# EAGLE design tarjeta (EAGLE 9.6.2)
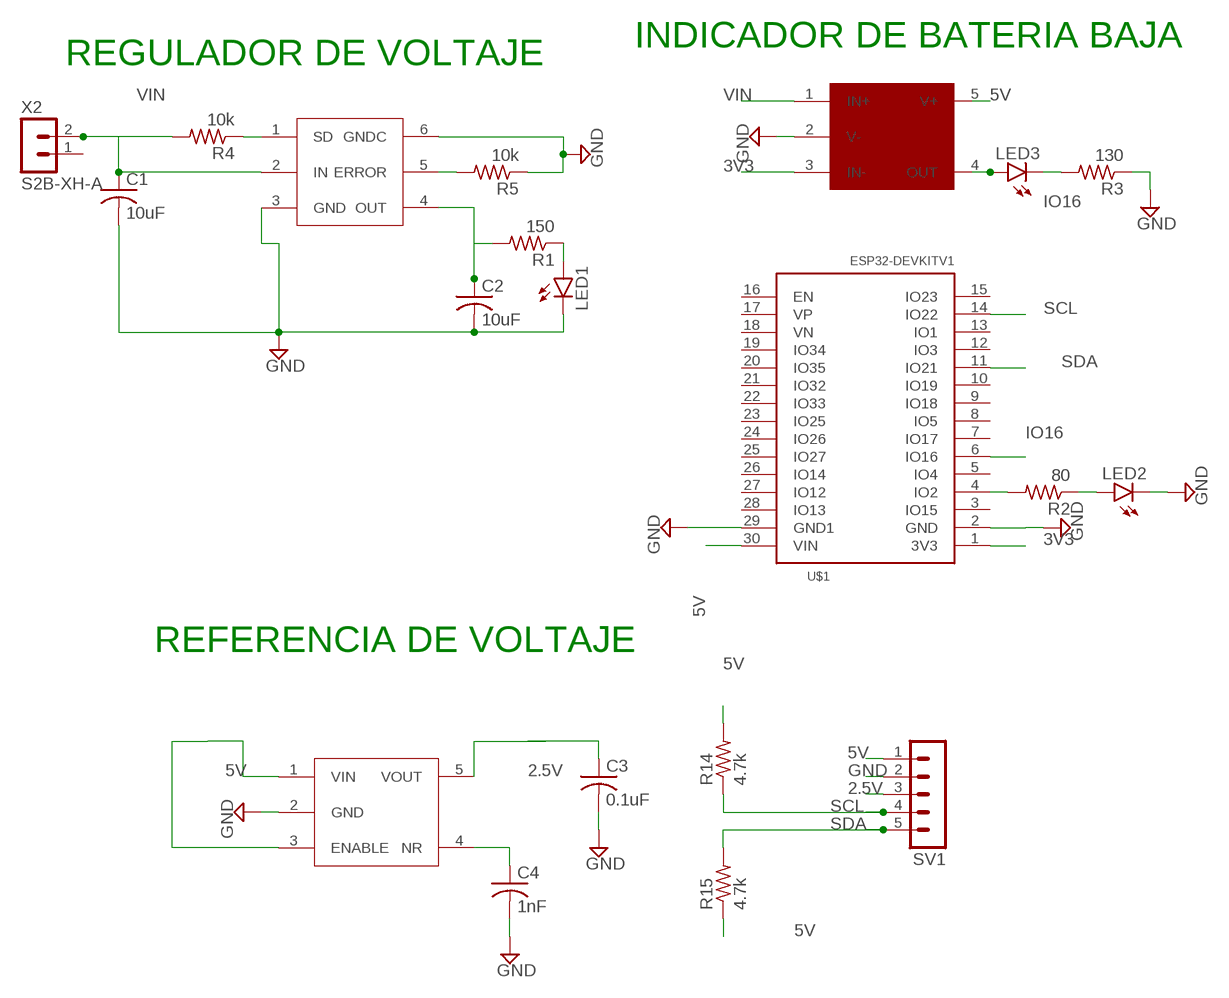
[diagram p0: schematic, sheet 1]

## Parts
.  LP3872ES  [TO263-5]
C1  10uF  C-USC0603  [C0603]
C2  10uF  C-USC0603  [C0603]
C3  0.1uF  C-USC0603  [C0603]
C4  1nF  C-USC0603  [C0603]
LED1  LEDSML0805  [SML0805]
LED2  LEDSML0805  [SML0805]
LED3  LEDSML0805  [SML0805]
R1  150  R-US_R0603  [R0603]
R2  80  R-US_R0603  [R0603]
R3  130  R-US_R0603  [R0603]
R4  10k  R-US_R0603  [R0603]
R5  10k  R-US_R0603  [R0603]
R14  4.7k  R-US_R0603  [R0603]
R15  4.7k  R-US_R0603  [R0603]
SV1  MA05-1  [MA05-1]
U$1  ESP32DEVKITV1  [ESP32-DEVKITV1]
U$3  REG113  [SOT23-5]
U$4  TL081-5  [SOT23-5]
X2  S2B-XH-A  [S2B-XH-A]

## Nets
2.5V: C3.1 SV1.3 U$3.5(VOUT)
3V3: U$1.1(3V3) U$4.3(IN-)
5V: R14.2 R15.1 SV1.1 U$1.30(VIN) U$3.1(VIN) U$3.3(ENABLE) U$4.5(V+)
GND: ..3(GND) ..6(GNDC) C1.2 C2.2 C3.2 C4.2 LED1.C LED2.C R3.1 R5.1 SV1.2 U$1.2(GND) U$1.29(GND1) U$3.2(GND) U$4.2(V-)
IO16: LED3.C R3.2 U$1.6(IO16)
N$1: LED1.A R1.1
N$2: LED3.A U$4.4(OUT)
N$3: R2.2 U$1.4(IO2)
N$4: LED2.A R2.1
N$5: ..1(SD) R4.1
N$6: C4.1 U$3.4(NR)
N$7: ..5(ERROR) R5.2
N$8: ..4(OUT) C2.1 R1.2
SCL: R14.1 SV1.4 U$1.14(IO22)
SDA: R15.2 SV1.5 U$1.11(IO21)
VIN: ..2(IN) C1.1 R4.2 U$4.1(IN+) X2.2
Unconnected: U$1.3(IO15) U$1.5(IO4) U$1.7(IO17) U$1.8(IO5) U$1.9(IO18) U$1.10(IO19) U$1.12(IO3) U$1.13(IO1) U$1.15(IO23) U$1.16(EN) U$1.17(VP) U$1.18(VN) U$1.19(IO34) U$1.20(IO35) U$1.21(IO32) U$1.22(IO33) U$1.23(IO25) U$1.24(IO26) U$1.25(IO27) U$1.26(IO14) U$1.27(IO12) U$1.28(IO13) X2.1

## Notes on the sheet
- INDICADOR DE BATERIA BAJA
- REGULADOR DE VOLTAJE
- REFERENCIA DE VOLTAJE

## Library data of the parts
. = LP3872ES:LP3872ES
C1-C4 = rcl:C-US: CAPACITOR, American symbol; SPICEPREFIX: C
LED1-LED3 = led:LED: LED OSRAM: - CHIPLED LG R971, LG N971, LY N971, LG Q971, LY Q971, LO R971, LY R971 LH N974, LH R974 LS Q976, LO Q976, LY Q976 LO Q996 - Hyper CHIPLED LW Q18S LB Q993, LB Q99A, LB R99A - SideLED LS A670, LO A670, LY A670, LG A670, LP A670 LB A673, LV A673, LT A673, LW A673 LH A674 LY A675 LS A676, LA A676, LO A676, LY A676, LW A676 LS A679, LY A679, LG A679 - Hyper Micro SIDELED® LS Y876, LA Y876, LO Y876, LY Y876 LT Y87S - SmartLED LW L88C, LW L88S LB L89C, LB L89S, LG L890 LS L89K, LO L89K, LY L89K LS L896, LA L896, LO L896, LY L896 - TOPLED LS T670, LO T670, LY T670, LG T670, LP T670 LSG T670, LSP T670, LSY T670, LOP T670, LYG T670 LG T671, LOG T671, LSG T671 LB T673, LV T673, LT T673, LW T673 LH T674 LS T676, LA T676, LO T676, LY T676, LB T676, LH T676, LSB T676, LW T676 LB T67C, LV T67C, LT T67C, LS T67K, LO T67K, LY T67K, LW E67C LS E67B, LA E67B, LO E67B, LY E67B, LB E67C, LV E67C, LT E67C LW T67C LS T679, LY T679, LG T679 LS T770, LO T770, LY T770, LG T770, LP T770 LB T773, LV T773, LT T773, LW T773 LH T774 LS E675, LA E675, LY E675, LS T675 LS T776, LA T776, LO T776, LY T776, LB T776 LHGB T686 LT T68C, LB T68C - Hyper Mini TOPLED® LB M676 - Mini TOPLED Santana® LG M470 LS M47K, LO M47K, LY M47K Source: http://www.osram.convergy.de LUXEON: - LUMILED® LXK2-PW12-R00, LXK2-PW12-S00, LXK2-PW14-U00, LXK2-PW14-V00 LXK2-PM12-R00, LXK2-PM12-S00, LXK2-PM14-U00 LXK2-PE12-Q00, LXK2-PE12-R00, LXK2-PE12-S00, LXK2-PE14-T00, LXK2-PE14-U00 LXK2-PB12-K00, LXK2-PB12-L00, LXK2-PB12-M00, LXK2-PB14-N00, LXK2-PB14-P00, LXK2-PB14-Q00 LXK2-PR12-L00, LXK2-PR12-M00, LXK2-PR14-Q00, LXK2-PR14-R00 LXK2-PD12-Q00, LXK2-PD12-R00, LXK2-PD12-S00 LXK2-PH12-R00, LXK2-PH12-S00 LXK2-PL12-P00, LXK2-PL12-Q00, LXK2-PL12-R00 Source: www.luxeon.com KINGBRIGHT: KA-3528ASYC Source: www.kingbright.com
R1-R5 R14 R15 = rcl:R-US_: RESISTOR, American symbol; SPICEPREFIX: R
SV1 = con-lstb:MA05-1: PIN HEADER; OC_FARNELL: unknown; OC_NEWARK: unknown
U$1 = ESP32-DEVKITV1:ESP32DEVKITV1
U$3 = REG113:REG113
U$4 = TL081:TL081-5
X2 = con-JST XH:S2B-XH: JST XH series header 2.50mm pitch disconnectable crimp style connectors, horizontal (side entry type), 2 pins

## Board
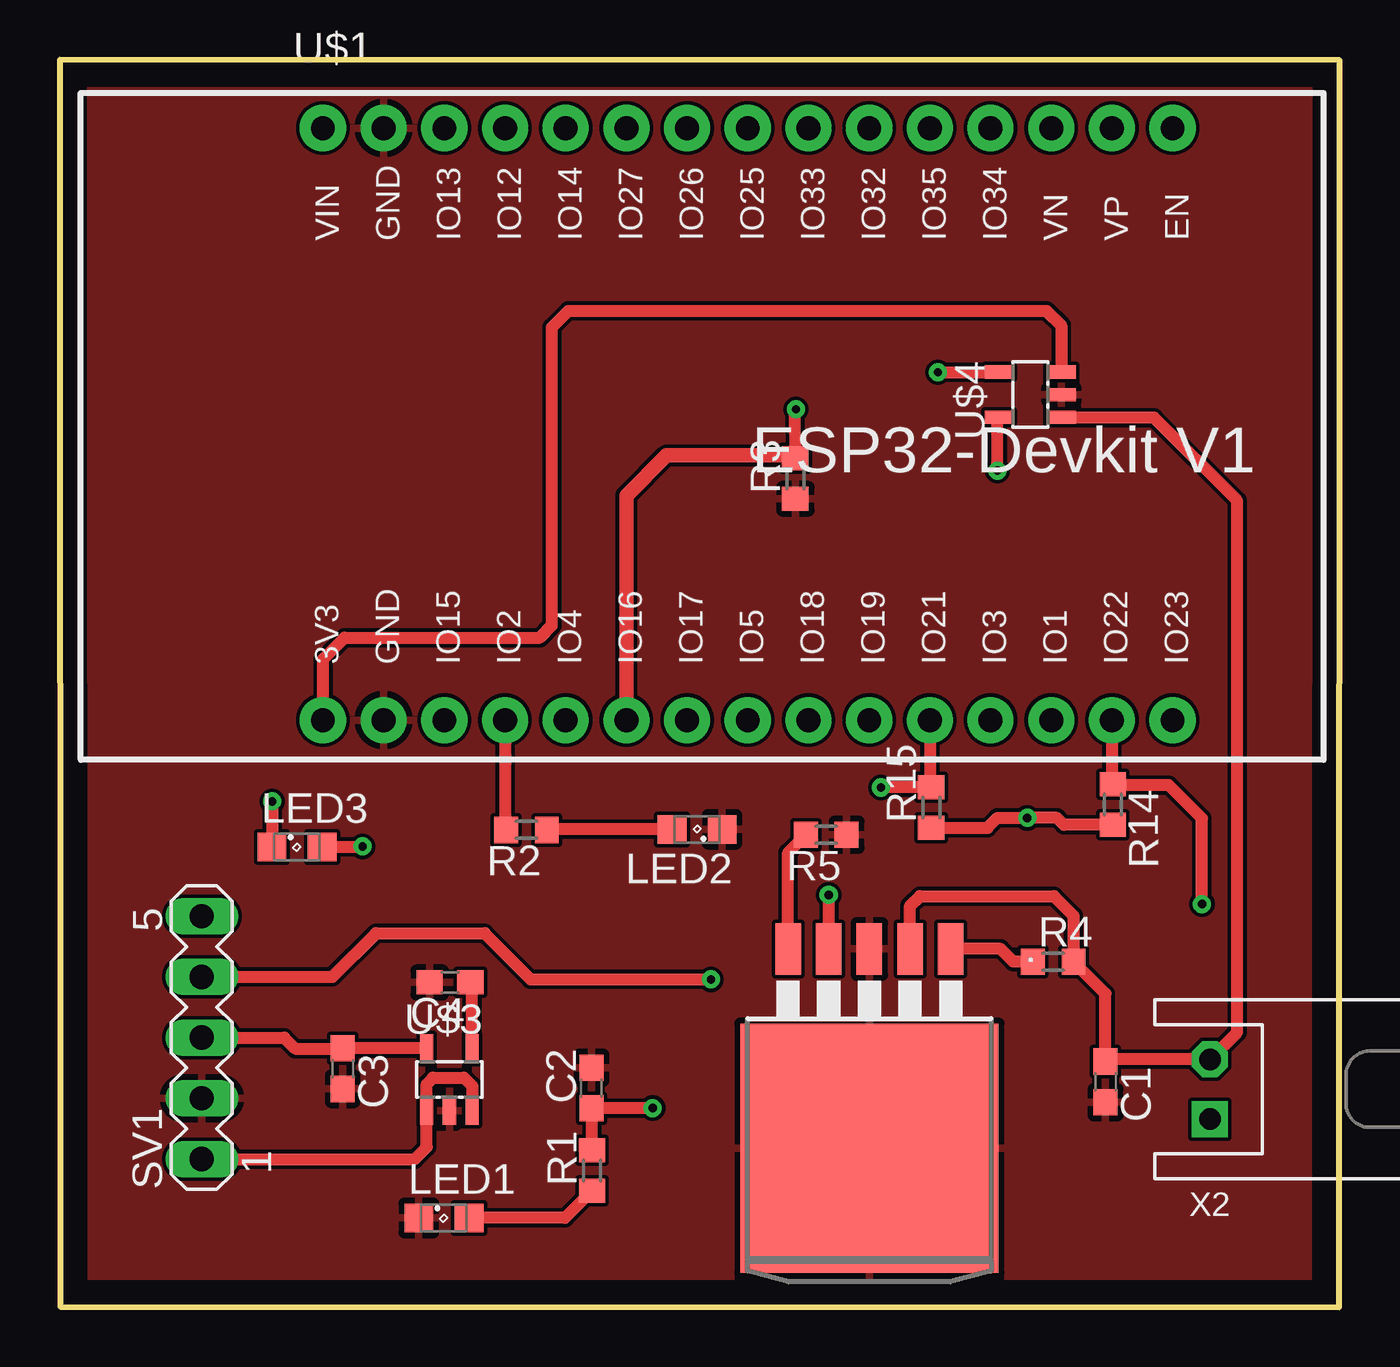
[diagram p1: board, top side]
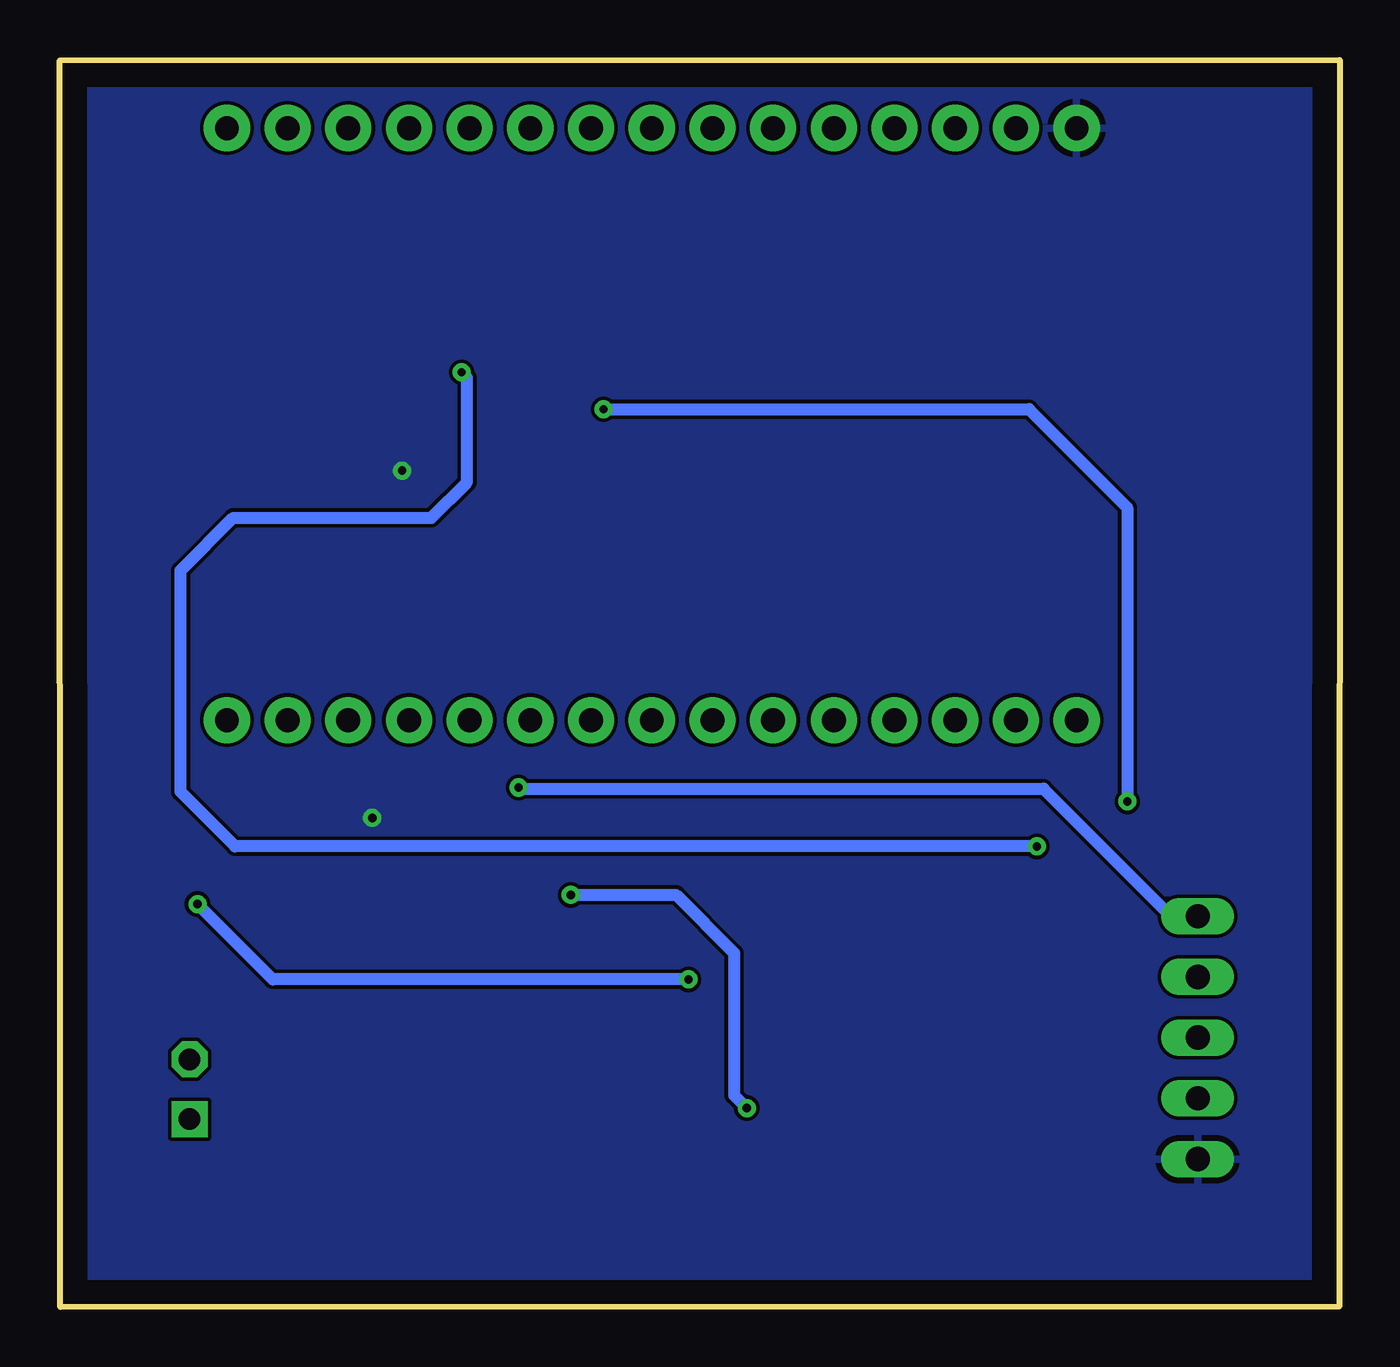
[diagram p2: board, bottom side, seen from below]

Size 53.57 x 52.19 mm. Coordinates in mm from the lower left corner, seen from the top.
Outline: 0.02,0.03 53.54,0 53.57,52.16 0,52.19 0.02,0.03
Copper layers (1*16): Top 0.035mm / dielectric 1.5mm / Bottom 0.035mm
Design rules "default": minimum track width 6mil, minimum drill 0.35mm, track to track 6mil, track to pad 6mil, pad to pad 6mil, via to via 6mil, smd to smd 6mil, copper to edge 40mil, drill to drill 6mil, minimum pad ring 10mil, minimum via ring 8mil, stop-mask expansion 4mil, vias tented up to drill 0mil, thermal gap 10mil

### Footprints (pad centres in the part's own frame; a part is rotated, then mirrored left to right if it is on the bottom)
TO263-5 = smd 1.067 x 2.159: 1 -3.404,-5.791; 2 -1.702,-5.791; 3 0,-5.791; 4 1.702,-5.791; 5 3.404,-5.791 | smd 10.8 x 10.41: 6 0,2.54
C0603 = smd 1.1 x 1: 1 -0.85,0; 2 0.85,0
SML0805 = smd 1.2 x 1.2: A 1.05,0; C -1.05,0
R0603 = smd 1 x 1.1: 1 -0.85,0; 2 0.85,0
MA05-1 = drill 1.016 long: 1 -5.08,0; 2 -2.54,0; 3 0,0; 4 2.54,0; 5 5.08,0
ESP32-DEVKITV1 = drill 1 pad 1.93: 1 -22.87,-13.54; 2 -20.33,-13.54; 3 -17.79,-13.54; 4 -15.25,-13.54; 5 -12.71,-13.54; 6 -10.17,-13.54; 7 -7.63,-13.54; 8 -5.09,-13.54; 9 -2.55,-13.54; 10 -0.01,-13.54; 11 2.53,-13.54; 12 5.07,-13.54; 13 7.61,-13.54; 14 10.15,-13.54; 15 12.69,-13.54; 16 12.69,11.23; 17 10.15,11.23; 18 7.61,11.23; 19 5.07,11.23; 20 2.53,11.23; 21 -0.01,11.23; 22 -2.55,11.23; 23 -5.09,11.23; 24 -7.63,11.23; 25 -10.17,11.23; 26 -12.71,11.23; 27 -15.25,11.23; 28 -17.79,11.23; 29 -20.33,11.23; 30 -22.87,11.23
SOT23-5 = smd 0.55 x 1.2: 1 -0.95,-1.3; 2 0,-1.3; 3 0.95,-1.3; 4 0.95,1.3; 5 -0.95,1.3
S2B-XH-A = drill 0.9 pad 1.5 square: 1 1.25,0 | drill 0.9 pad 1.5 octagon: 2 -1.25,0

### Placement (x,y rotation side)
.  33.88,9.2 180 top
C1  43.76,9.42 270 top
C2  22.25,9.17 90 top
C3  11.84,9.98 270 top
C4  16.33,13.59 180 top
LED1  16.08,3.73 0 top
LED2  26.67,19.99 180 top
LED3  9.93,19.25 0 top
R1  22.28,5.71 90 top
R2  19.53,19.96 180 top
R3  30.79,34.67 90 top
R4  41.58,14.45 0 top
R5  32.08,19.76 180 top
R14  44.07,21.03 270 top
R15  36.48,20.9 90 top
SV1  5.94,11.28 90 top
U$1  33.88,38.1 0 top
U$3  16.31,9.53 0 top
U$4  40.62,38.18 90 top
X2  48.13,9.12 270 top

### Tracks (layer width: path | path; a pad name or v marks a point on that pad's centre or on a via)
2.5V
  Top 0.508: U$3.5 11.84,10.82 C3.1 11.82,10.82 9.85,10.82 9.4,11.28 SV1.3
3V3
  Top 0.508: U$1.1 11.01,27.12 11.91,28.02 20.09,28.02 20.6,28.52 20.6,41 21.29,41.68 41.3,41.68 41.91,41.07 U$4.3
5V  (via drill 0.35)
  Top 0.305: 39.24,37.16 U$4.5
  Top 0.508: v39.24,35 39.24,37.16 | U$3.3 17.26,9.26 16.92,9.6 15.62,9.6 15.36,9.34 U$3.1 15.36,6.7 14.86,6.2 SV1.1 | R15.1 38.83,20.05 39.24,20.47 v40.49,20.47 41.73,20.47 42.02,20.18 R14.2
  pour Bottom: 0.03,52.2 53.54,52.2 53.54,0 0.05,0 0.03,0.03
GND
  pour Top: 0,52.12 0,0.05 0.03,0.03 53.47,0.03 53.52,-0.03 53.54,0 53.54,52.17 0.03,52.17
IO16  (via drill 0.35)
  Top 0.508: R3.2 30.76,37.52 v30.81,37.57 | v8.89,21.16 8.89,19.26 LED3.C
  Top 0.61: U$1.6 23.71,33.95 25.4,35.64 30.77,35.64
  Top 0.813: 30.77,35.64 R3.2
  Bottom 0.508: v30.81,37.57 13,37.57 8.89,33.45 v8.89,21.16
N$1
  Top 0.508: R1.1 21.14,3.73 LED1.A
N$2  (via drill 0.35)
  Top 0.508: LED3.A 12.65,19.25 v12.67,19.28 | v36.75,39.12 39.3,39.12 U$4.4
  Bottom 0.508: v12.67,19.28 46.23,19.28 48.51,21.56 48.51,30.81 46.3,33.02 38.02,33.02 36.52,34.52 36.52,38.89 v36.75,39.12
N$3
  Top 0.508: U$1.4 18.63,20.02
  Top 0.813: 18.63,20.02 R2.2
N$4
  Top 0.508: LED2.A 20.51,19.99
  Top 0.813: 20.51,19.99 R2.1
N$5
  Top 0.508: R4.1 39.9,14.45 39.37,14.99 ..1
N$6
  Top 0.508: U$3.4 17.26,13.52 C4.1
N$7
  Top 0.508: ..5 30.48,19.01 R5.2
N$8  (via drill 0.35)
  Top 0.508: ..4 v32.18,17.25 | v24.82,8.33 22.26,8.33 | 22.26,8.33 C2.1 | R1.2 22.28,8.32 22.26,8.33
  Bottom 0.508: v32.18,17.25 27.79,17.25 25.35,14.81 25.35,8.87 v24.82,8.33
SCL  (via drill 0.35)
  Top 0.508: U$1.14 44.03,21.92 R14.1 44.11,21.84 46.41,21.84 47.8,20.45 v47.8,16.87 | SV1.4 11.4,13.82 13.23,15.65 17.78,15.65 19.71,13.72 v27.25,13.72
  Bottom 0.508: v27.25,13.72 44.65,13.72 v47.8,16.87
SDA  (via drill 0.35)
  Top 0.508: U$1.11 36.41,21.81 R15.2 v34.38,21.75 v34.37,21.74
  Bottom 0.508: SV1.5 7.06,16.36 12.39,21.69 34.32,21.69 v34.37,21.74
VIN
  Top 0.508: U$4.1 41.93,37.21 45.8,37.21 49.28,33.73 49.28,11.51 X2.2 43.86,10.37 C1.1 43.76,13.12 R4.2 42.43,16.37 41.61,17.2 35.99,17.2 35.59,16.79 ..2